# EAGLE design DevControl (EAGLE 9.4.2)
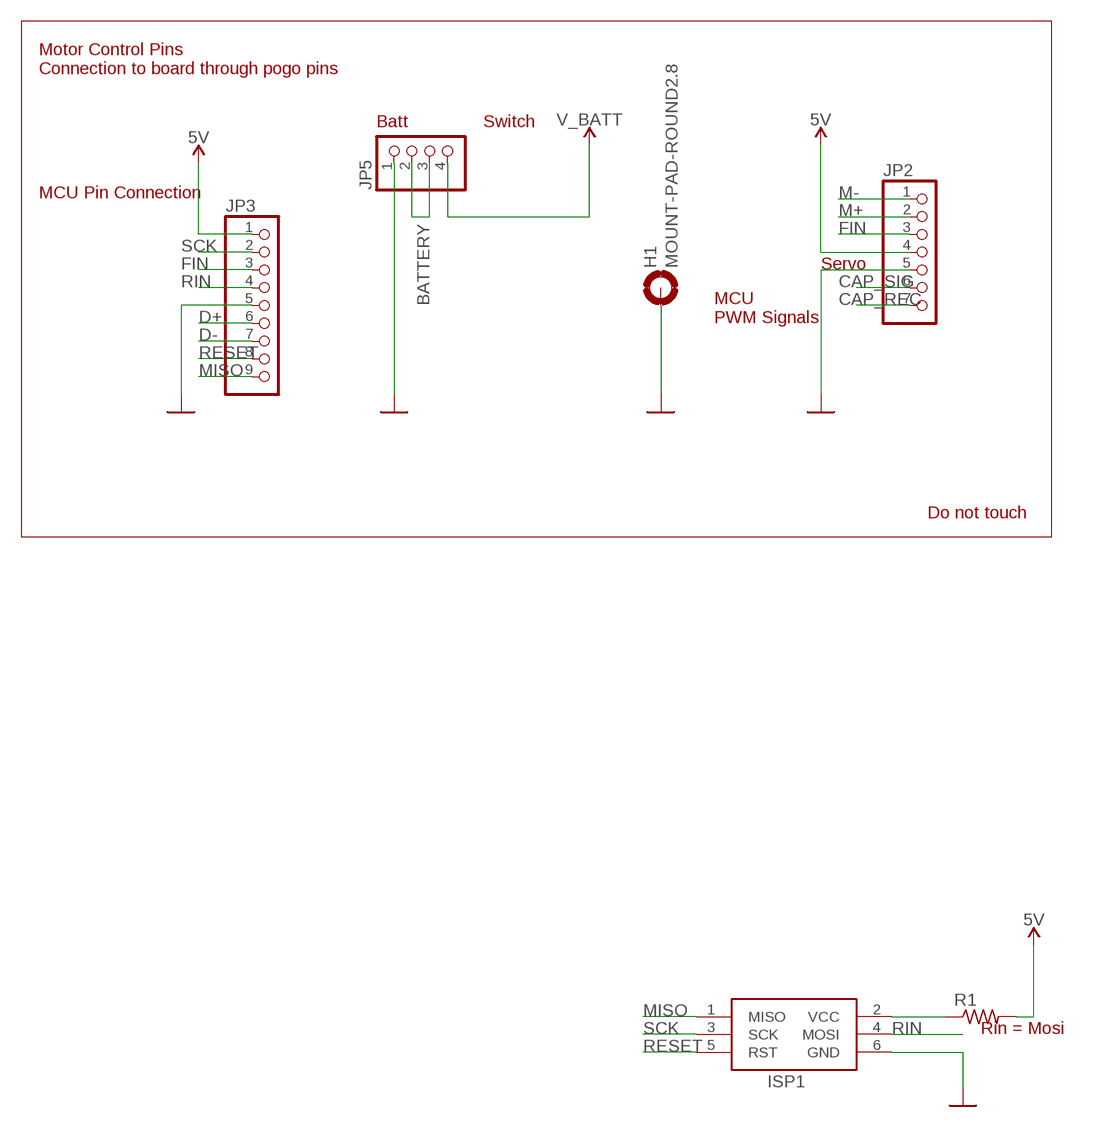
[diagram p0: schematic, sheet 1]

## Parts
H1  MOUNT-PAD-ROUND2.8  [2,8-PAD]
ISP1  AVRISP-6  [AVRISP]
JP2  HEADER-1X7  [1X07_OVAL]
JP3  HEADER-1X9  [1X09_OVAL]
JP5  HEADER-1X4  [1X04_OVAL]
R1  R-US_R0805  [R0805]

## Nets
5V: JP2.4 JP3.1 R1.2
BATTERY: JP5.2 JP5.3
CAP_REC: JP2.7
CAP_SIG: JP2.6
D+: JP3.6
D-: JP3.7
FIN: JP2.3 JP3.3
GND: H1.B2,8(MOUNT) ISP1.6(GND) JP2.5 JP3.5 JP5.1
M+: JP2.2
M-: JP2.1
MISO: ISP1.1(MISO) JP3.9
N$1: ISP1.2(VCC) R1.1
RESET: ISP1.5(RST) JP3.8
RIN: ISP1.4(MOSI) JP3.4
SCK: ISP1.3(SCK) JP3.2
V_BATT: JP5.4

## Notes on the sheet
- Motor Control Pins
  Connection to board through pogo pins
- Batt | Switch
- MCU Pin Connection
- Servo
- MCU
  PWM Signals
- Do not touch
- Rin = Mosi

## Library data of the parts
H1 = holes:MOUNT-PAD-ROUND: MOUNTING PAD, round
ISP1 = adafruit:AVRISP: AVR ISP HEADER Standard 6 pin header for AVR programming
JP2 = microbuilder:HEADER-1X7: PIN HEADER
JP3 = microbuilder:HEADER-1X9: PIN HEADER
JP5 = microbuilder:HEADER-1X4: PIN HEADER
R1 = rcl:R-US_: RESISTOR, American symbol; SPICEPREFIX: R

## Board
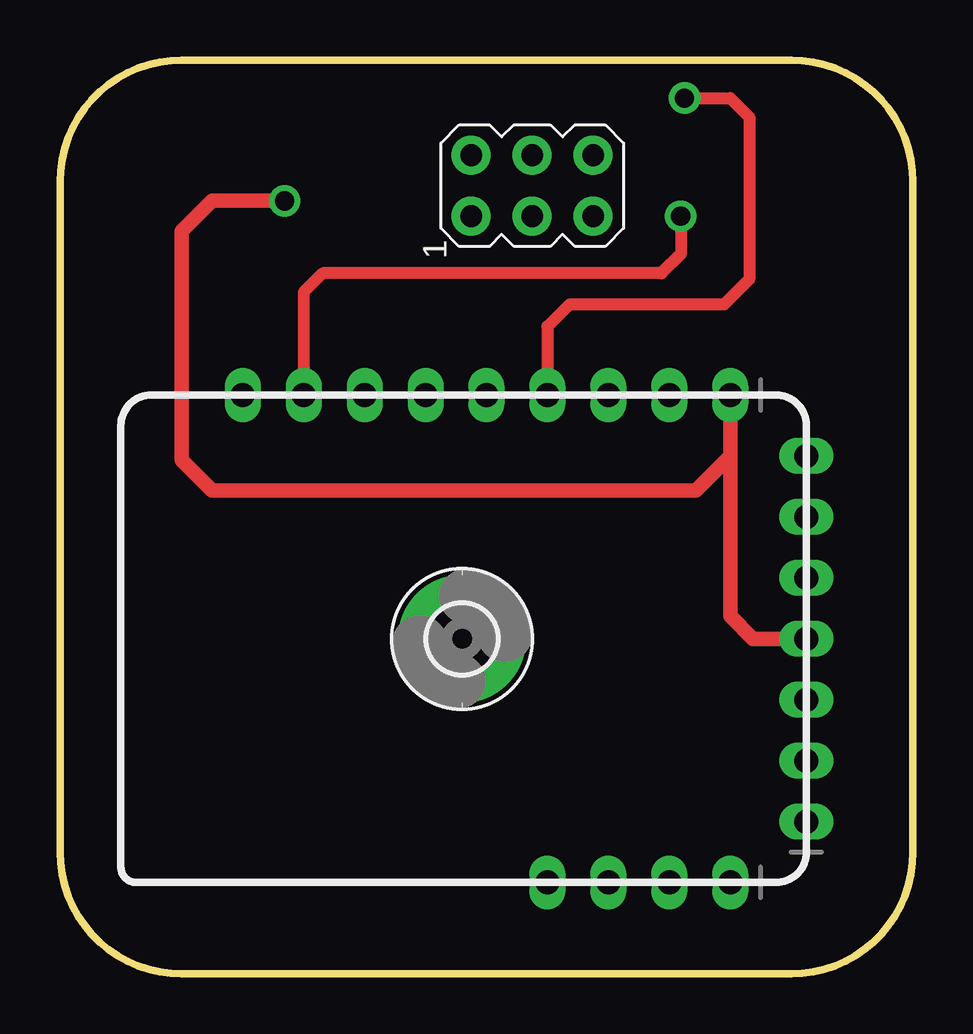
[diagram p1: board, top side]
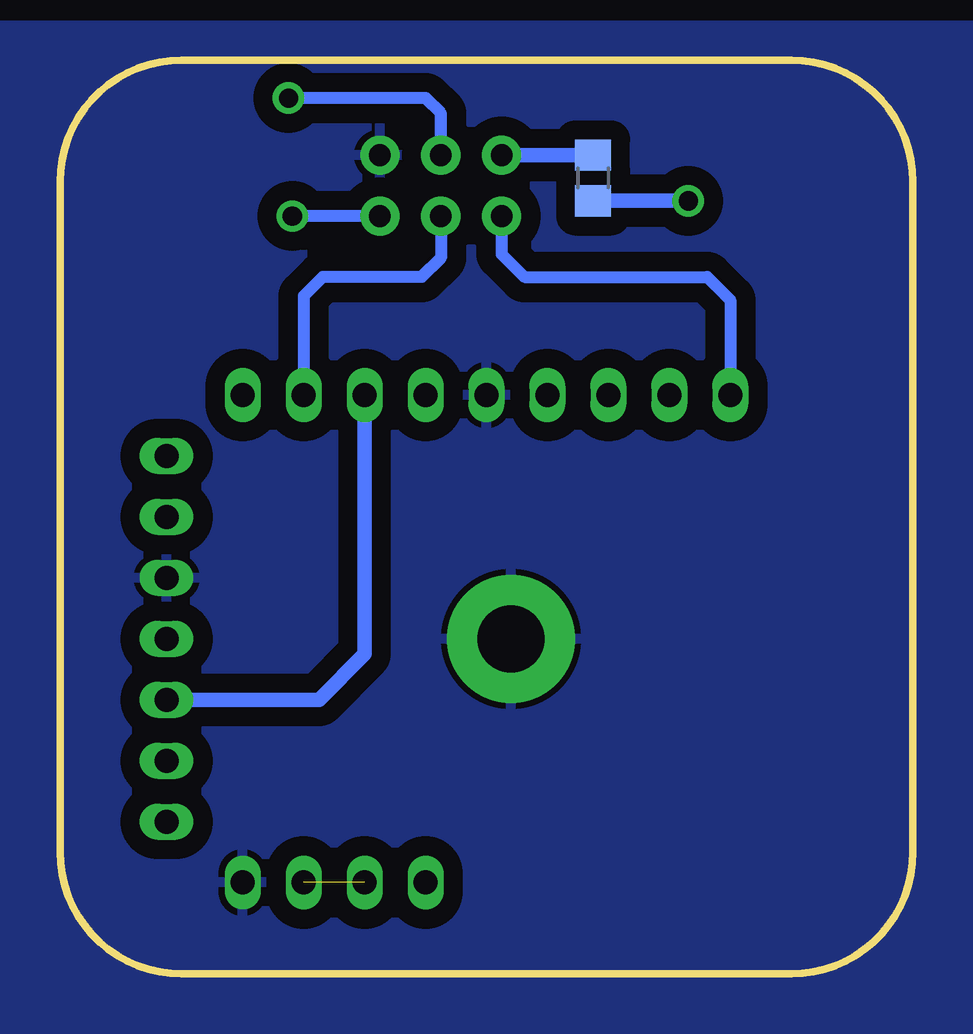
[diagram p2: board, bottom side, seen from below]

Size 35.56 x 38.1 mm. Coordinates in mm from the lower left corner, seen from the top.
Outline: 5.08,0 arc-90 0,5.08 0,33.02 arc-90 5.08,38.1 30.48,38.1 arc-90 35.56,33.02 35.56,5.08 arc-90 30.48,0 5.08,0
Copper layers (1*16): Top 0.035mm / dielectric 1.5mm / Bottom 0.035mm
Design rules "OthermillDRC_1_32_v2": minimum track width 8mil, minimum drill 0.8mm, track to track 0.794003125mm, track to pad 0.794003125mm, pad to pad 0.794003125mm, via to via 0.794003125mm, smd to smd 0mil, copper to edge 0mil, drill to drill 1mil, minimum pad ring 10mil, minimum via ring 10mil, stop-mask expansion 1mil, vias tented up to drill 30mil, thermal gap 10mil

### Footprints (pad centres in the part's own frame; a part is rotated, then mirrored left to right if it is on the bottom)
2,8-PAD = drill 2.8 pad 5.334: B2,8 0,0
AVRISP = drill 0.9 pad 1.626: 1 -1.27,2.54; 2 1.27,2.54; 3 -1.27,0; 4 1.27,0; 5 -1.27,-2.54; 6 1.27,-2.54
1X07_OVAL = drill 1 long: 1 -7.62,0; 2 -5.08,0; 3 -2.54,0; 4 0,0; 5 2.54,0; 6 5.08,0; 7 7.62,0
1X09_OVAL = drill 1 long: 1 -10.16,0; 2 -7.62,0; 3 -5.08,0; 4 -2.54,0; 5 0,0; 6 2.54,0; 7 5.08,0; 8 7.62,0; 9 10.16,0
1X04_OVAL = drill 1 long: 1 -3.81,0; 2 -1.27,0; 3 1.27,0; 4 3.81,0
R0805 = smd 1.3 x 1.5: 1 -0.95,0; 2 0.95,0

### Placement (x,y rotation side)
H1  16.76,13.97 0 top
ISP1  19.69,32.86 90 top
JP2  31.12,13.97 90 top
JP3  17.78,24.13 180 top
JP5  24.13,3.81 180 top
R1  13.33,33.18 270 bottom

### Tracks (layer width: path | path; a pad name or v marks a point on that pad's centre or on a via)
5V  (via drill 0.8)
  Top 0.61: v9.37,32.23 6.35,32.23 5.08,30.96 5.08,21.43 6.35,20.16 26.51,20.16 27.94,21.59 | JP2.4 28.89,13.97 27.94,14.92 27.94,21.59 | 27.94,21.59 JP3.1
  Bottom 0.61: R1.2 v9.37,32.23
BATTERY  (1 unrouted)
FIN
  Bottom 0.61: JP2.3 24.77,11.43 22.86,13.34 JP3.3
GND
  pour Bottom: -6.51,39.53 42.23,39.53 42.23,-3.65 -6.51,-3.65
MISO
  Bottom 0.508: ISP1.1 17.15,30 16.19,29.05 8.57,29.05 7.62,28.1 JP3.9
N$1
  Bottom 0.203: R1.1
  Bottom 0.61: ISP1.2 R1.1
RESET  (via drill 0.8)
  Top 0.508: v25.88,31.59 25.88,30 25.08,29.21 10.95,29.21 10.16,28.42 JP3.8
  Bottom 0.508: ISP1.5 v25.88,31.59
RIN  (via drill 0.8)
  Top 0.508: v26.03,36.51 27.94,36.51 28.73,35.72 28.73,28.96 27.69,27.91 21.24,27.91 20.32,26.99 JP3.4
  Bottom 0.508: ISP1.4 19.69,35.88 20.32,36.51 v26.03,36.51
SCK
  Bottom 0.508: ISP1.3 19.69,29.84 20.48,29.05 24.61,29.05 25.4,28.26 JP3.2